# Altium project 140521.PrjPcb
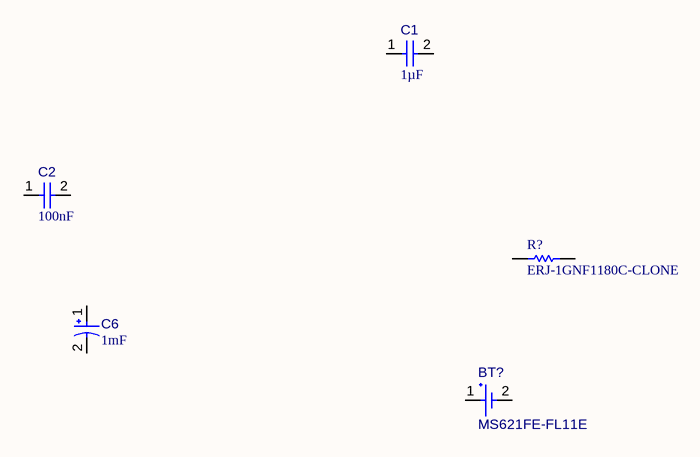
[diagram p0: Sheet1.SchDoc]
1 sheet, 5 parts. Net scope: global (net labels, ports and power ports of the same name join across sheets).
Board file: PCB1.PcbDoc

## Sheet Sheet1.SchDoc
size A; SheetNumber: 1; SheetTotal: 1

### Parts
BT?  MS621FE-FL11E  [SEIK-MS621FE-FL11E-2_V]
C1  value 1µF  [CAPC0603(1608)100_L]  (hidden comment: Capacitor 1µF +/-0.1% 25V 0603)
C2  value 100nF  [CAPC2013X95X50ML10T25]  (hidden comment: Capacitor 100 nF +/-10% 50 V 0805)
C6  value 1mF  [CAPPR65-500-2000X1000X2200]  (hidden comment: ECA1EM102)
R?  ERJ-1GNF1180C-CLONE  [RESC0201(0603)_M]

### Nets

Not connected (* = marked no-connect by the designer): BT? 1(+) 2(-); C1 1 2; C2 1 2; C6 1 2; R? 1 2

### Library data of the parts
BT? = CMP-00029-00000-1: MS Lihium Rechargeable Battery, 3 V, -20 to 60 degC, Tray; RoHS Compliant: NotApplicable; Mounting Technology: WithLeads; Pins: 2
C1 = CMP-001-00055-2: Chip Capacitor, 1µF +/-0.1%, 25V, 0603, Thickness 1 mm; Tolerance: 20%; Max Operating Temperature: 85°C; Voltage Rating: 25V; Min Operating Temperature: -55°C; Case/Package: 0805; Mounting Technology: SMT; Pins: 2
C2 = CMP-001-00018-4: Chip Capacitor, 100 nF, +/- 10%, 50 V, 0805 (2012 Metric); Voltage Rating: 50V; Capacitor Type: Ceramic; RoHS Compliant: True; Max Operating Temperature: 125°C; Mounting Technology: SM; Case/Package: 0805; Tolerance: 10%; Min Operating Temperature: -55°C; Pins: 2
C6 = CMP-001-00023-5: Aluminum Electrolytic Capacitor, 1000 uF, +/- 20%, 25 V, -40 to 85 degC, 2-Pin THD, RoHS, Bulk; Manufacturer: Panasonic; Ripple Current: 850mA; Voltage Rating: 25V; Package Reference: CAPPR65-500-2000X1000X2200; Max Operating Temperature: 85°C; Lead Pitch: 5mm; Mounting Technology: TH; Diameter: 10mm; RoHS Compliant: True; Tolerance: 20%; Min Operating Temperature: -40°C; Manufacturer URL: http://www.panasonic.com/; Packaging: Bulk; Datasheet URL: https://industrial.panasonic.com/cdbs/www-data/pdf/RDF0000/ABA0000C1218.pdf; Package Quantity: 200; Capacitor Type: Electrolytic; Datasheet Version: Rev. 05, 10/2016; Package Description: 2-Pin Radial Lead, Dia 10 mm, Height 22 mm; Case/Package: Radial
R? = CMP-00029-00003-1: Thick Film Resistors 0201 118ohm 1% HalogenFree AEC-Q200 test 24112020; Resistance: 118R; Max Power Dissipation: 50mW; Voltage Rating: 25V; Temperature Coefficient: 200ppm/°C; Radiation Hardening: No; Parameter 1: 24112020; Max Operating Temperature: 125°C; Length: 0.024inch; Case Code (Metric): 0603; Package Quantity: 15000; Packaging: Tape and Reel; Weight: 6E-06oz; Case/Package: 0201; Width: 0.012inch; Termination: SMD/SMT; Height: 0.01inch; Tolerance: 1%; Number of Terminations: 2; Composition: Thick Film; Case Code (Imperial): 0201; Number of Pins: 2; Contact Plating: Tin,Matte; Min Operating Temperature: -55°C; Power Rating: 50mW; Mount: Surface Mount; Features: Automotive AEC-Q200